# Altium schematic sheet DDR2Module.SchDoc
size A4; SheetNumber: 8; SheetTotal: 10
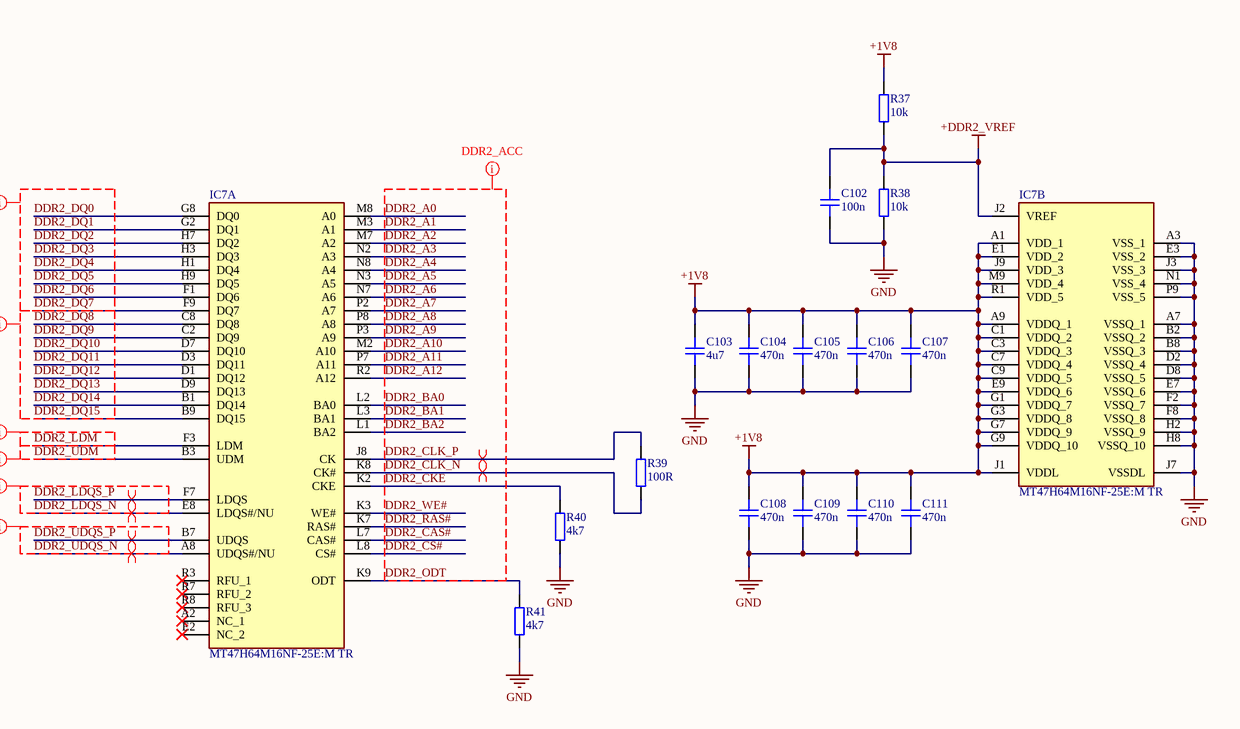
[diagram p0: DDR2Module.SchDoc]

## Parts
C102  100n  [CAP_0402]
C103  4u7  [CAP_0402]
C104  470n  [CAP_0201]
C105  470n  [CAP_0201]
C106  470n  [CAP_0201]
C107  470n  [CAP_0201]
C108  470n  [CAP_0201]
C109  470n  [CAP_0201]
C110  470n  [CAP_0201]
C111  470n  [CAP_0201]
IC7  MT47H64M16NF-25E:M TR  [BGA84C80P9X15_800X1250X120]  (parts A,B of 2)
R37  10k  [RES_0402]
R38  10k  [RES_0402]
R39  100R  [RES_0201]
R40  4k7  [RES_0201]
R41  4k7  [RES_0201]

## Nets
+1V8: C103.2 C104.2 C105.2 C106.2 C107.2 C108.2 C109.2 C110.2 C111.2 IC7.A1(VDD_1) IC7.A9(VDDQ_1) IC7.C1(VDDQ_2) IC7.C3(VDDQ_3) IC7.C7(VDDQ_4) IC7.C9(VDDQ_5) IC7.E1(VDD_2) IC7.E9(VDDQ_6) IC7.G1(VDDQ_7) IC7.G3(VDDQ_8) IC7.G7(VDDQ_9) IC7.G9(VDDQ_10) IC7.J1(VDDL) IC7.J9(VDD_3) IC7.M9(VDD_4) IC7.R1(VDD_5) R37.2
+DDR2_VREF: C102.1 IC7.J2(VREF) R37.1 R38.2
GND: C102.2 C103.1 C104.1 C105.1 C106.1 C107.1 C108.1 C109.1 C110.1 C111.1 IC7.A3(VSS_1) IC7.A7(VSSQ_1) IC7.B2(VSSQ_2) IC7.B8(VSSQ_3) IC7.D2(VSSQ_4) IC7.D8(VSSQ_5) IC7.E3(VSS_2) IC7.E7(VSSQ_6) IC7.F2(VSSQ_7) IC7.F8(VSSQ_8) IC7.H2(VSSQ_9) IC7.H8(VSSQ_10) IC7.J3(VSS_3) IC7.J7(VSSDL) IC7.N1(VSS_4) IC7.P9(VSS_5) R38.1 R40.1 R41.1
DDR2_A0: IC7.M8(A0)
DDR2_A1: IC7.M3(A1)
DDR2_A2: IC7.M7(A2)
DDR2_A3: IC7.N2(A3)
DDR2_A4: IC7.N8(A4)
DDR2_A5: IC7.N3(A5)
DDR2_A6: IC7.N7(A6)
DDR2_A7: IC7.P2(A7)
DDR2_A8: IC7.P8(A8)
DDR2_A9: IC7.P3(A9)
DDR2_A10: IC7.M2(A10)
DDR2_A11: IC7.P7(A11)
DDR2_A12: IC7.R2(A12)
DDR2_BA0: IC7.L2(BA0)
DDR2_BA1: IC7.L3(BA1)
DDR2_BA2: IC7.L1(BA2)
DDR2_CAS#: IC7.L7(CAS#)
DDR2_CKE: IC7.K2(CKE) R40.2
DDR2_CLK_N: IC7.K8(CK#) R39.1
DDR2_CLK_P: IC7.J8(CK) R39.2
DDR2_CS#: IC7.L8(CS#)
DDR2_DQ0: IC7.G8(DQ0)
DDR2_DQ1: IC7.G2(DQ1)
DDR2_DQ2: IC7.H7(DQ2)
DDR2_DQ3: IC7.H3(DQ3)
DDR2_DQ4: IC7.H1(DQ4)
DDR2_DQ5: IC7.H9(DQ5)
DDR2_DQ6: IC7.F1(DQ6)
DDR2_DQ7: IC7.F9(DQ7)
DDR2_DQ8: IC7.C8(DQ8)
DDR2_DQ9: IC7.C2(DQ9)
DDR2_DQ10: IC7.D7(DQ10)
DDR2_DQ11: IC7.D3(DQ11)
DDR2_DQ12: IC7.D1(DQ12)
DDR2_DQ13: IC7.D9(DQ13)
DDR2_DQ14: IC7.B1(DQ14)
DDR2_DQ15: IC7.B9(DQ15)
DDR2_LDM: IC7.F3(LDM)
DDR2_LDQS_N: IC7.E8(LDQS#/NU)
DDR2_LDQS_P: IC7.F7(LDQS)
DDR2_ODT: IC7.K9(ODT) R41.2
DDR2_RAS#: IC7.K7(RAS#)
DDR2_UDM: IC7.B3(UDM)
DDR2_UDQS_N: IC7.A8(UDQS#/NU)
DDR2_UDQS_P: IC7.B7(UDQS)
DDR2_WE#: IC7.K3(WE#)

Not connected (* = marked no-connect by the designer): IC7 A2(NC_1)* E2(NC_2)* R3(RFU_1)* R7(RFU_2)* R8(RFU_3)*

## Layout directives
differential pair: DDR2_CLK_N, DDR2_CLK_P, DDR2_LDQS_N, DDR2_LDQS_P, DDR2_UDQS_N, DDR2_UDQS_P
mark named DDR2_BL0: DDR2_DQ0, DDR2_DQ1, DDR2_DQ2, DDR2_DQ3, DDR2_DQ4, DDR2_DQ5, DDR2_DQ6, DDR2_DQ7, DDR2_LDM, DDR2_LDQS_N, DDR2_LDQS_P
mark named DDR2_ACC: DDR2_A0, DDR2_A1, DDR2_A2, DDR2_A3, DDR2_A4, DDR2_A5, DDR2_A6, DDR2_A7, DDR2_A8, DDR2_A9, DDR2_A10, DDR2_A11, DDR2_A12, DDR2_BA0, DDR2_BA1, DDR2_BA2, DDR2_CAS#, DDR2_CKE, DDR2_CLK_N, DDR2_CLK_P, DDR2_CS#, DDR2_ODT, DDR2_RAS#, DDR2_WE#
mark named DDR2_BL1: DDR2_DQ7, DDR2_DQ8, DDR2_DQ9, DDR2_DQ10, DDR2_DQ11, DDR2_DQ12, DDR2_DQ13, DDR2_DQ14, DDR2_DQ15, DDR2_LDM, DDR2_UDM, DDR2_UDQS_N, DDR2_UDQS_P

## Library data of the parts
C102 C103 = CAP_0402: Capacitor SMD 0402; Manufacturer: *; Manufacturer Part Number: *; Distributor Link: *; LCSC: *; Rating: *; Dielectric: *
C104-C111 = CAP_0201: Capacitor SMD 0201; Manufacturer: *; Manufacturer Part Number: *; Distributor Link: *; LCSC: *; Rating: *; Dielectric: *
IC7 = MT47H64M16NF-25E:M TR: Integrated Circuit; Manufacturer_Name: Micron; Datasheet Link: https://www.micron.com/-/media/client/global/documents/products/data-sheet/dram/ddr2/1gb_ddr2.pdf; Height: 1.2mm; Manufacturer_Part_Number: MT47H64M16NF-25E:M TR; Mouser Part Number: 340-248361-REEL; Mouser Price/Stock: https://www.mouser.co.uk/ProductDetail/Micron/MT47H64M16NF-25EM-TR?qs=taEdVNyAfdEAmKNgRBNaGQ%3D%3D; Arrow Part Number: MT47H64M16NF-25E:M TR; Arrow Price/Stock: https://www.arrow.com/en/products/mt47h64m16nf-25em-tr/micron-technology?region=europe
R37 R38 = RES_0402: Resistor SMD 0402; Manufacturer: *; Manufacturer Part Number: *; Distributor Link: *; LCSC: *
R39-R41 = RES_0201: Resistor SMD 0201; Manufacturer: *; Manufacturer Part Number: *; Distributor Link: *; LCSC: *